# EasyEDA Pro project TDX_Pro_mainboard_1.1.epro

# Board PCB2_2
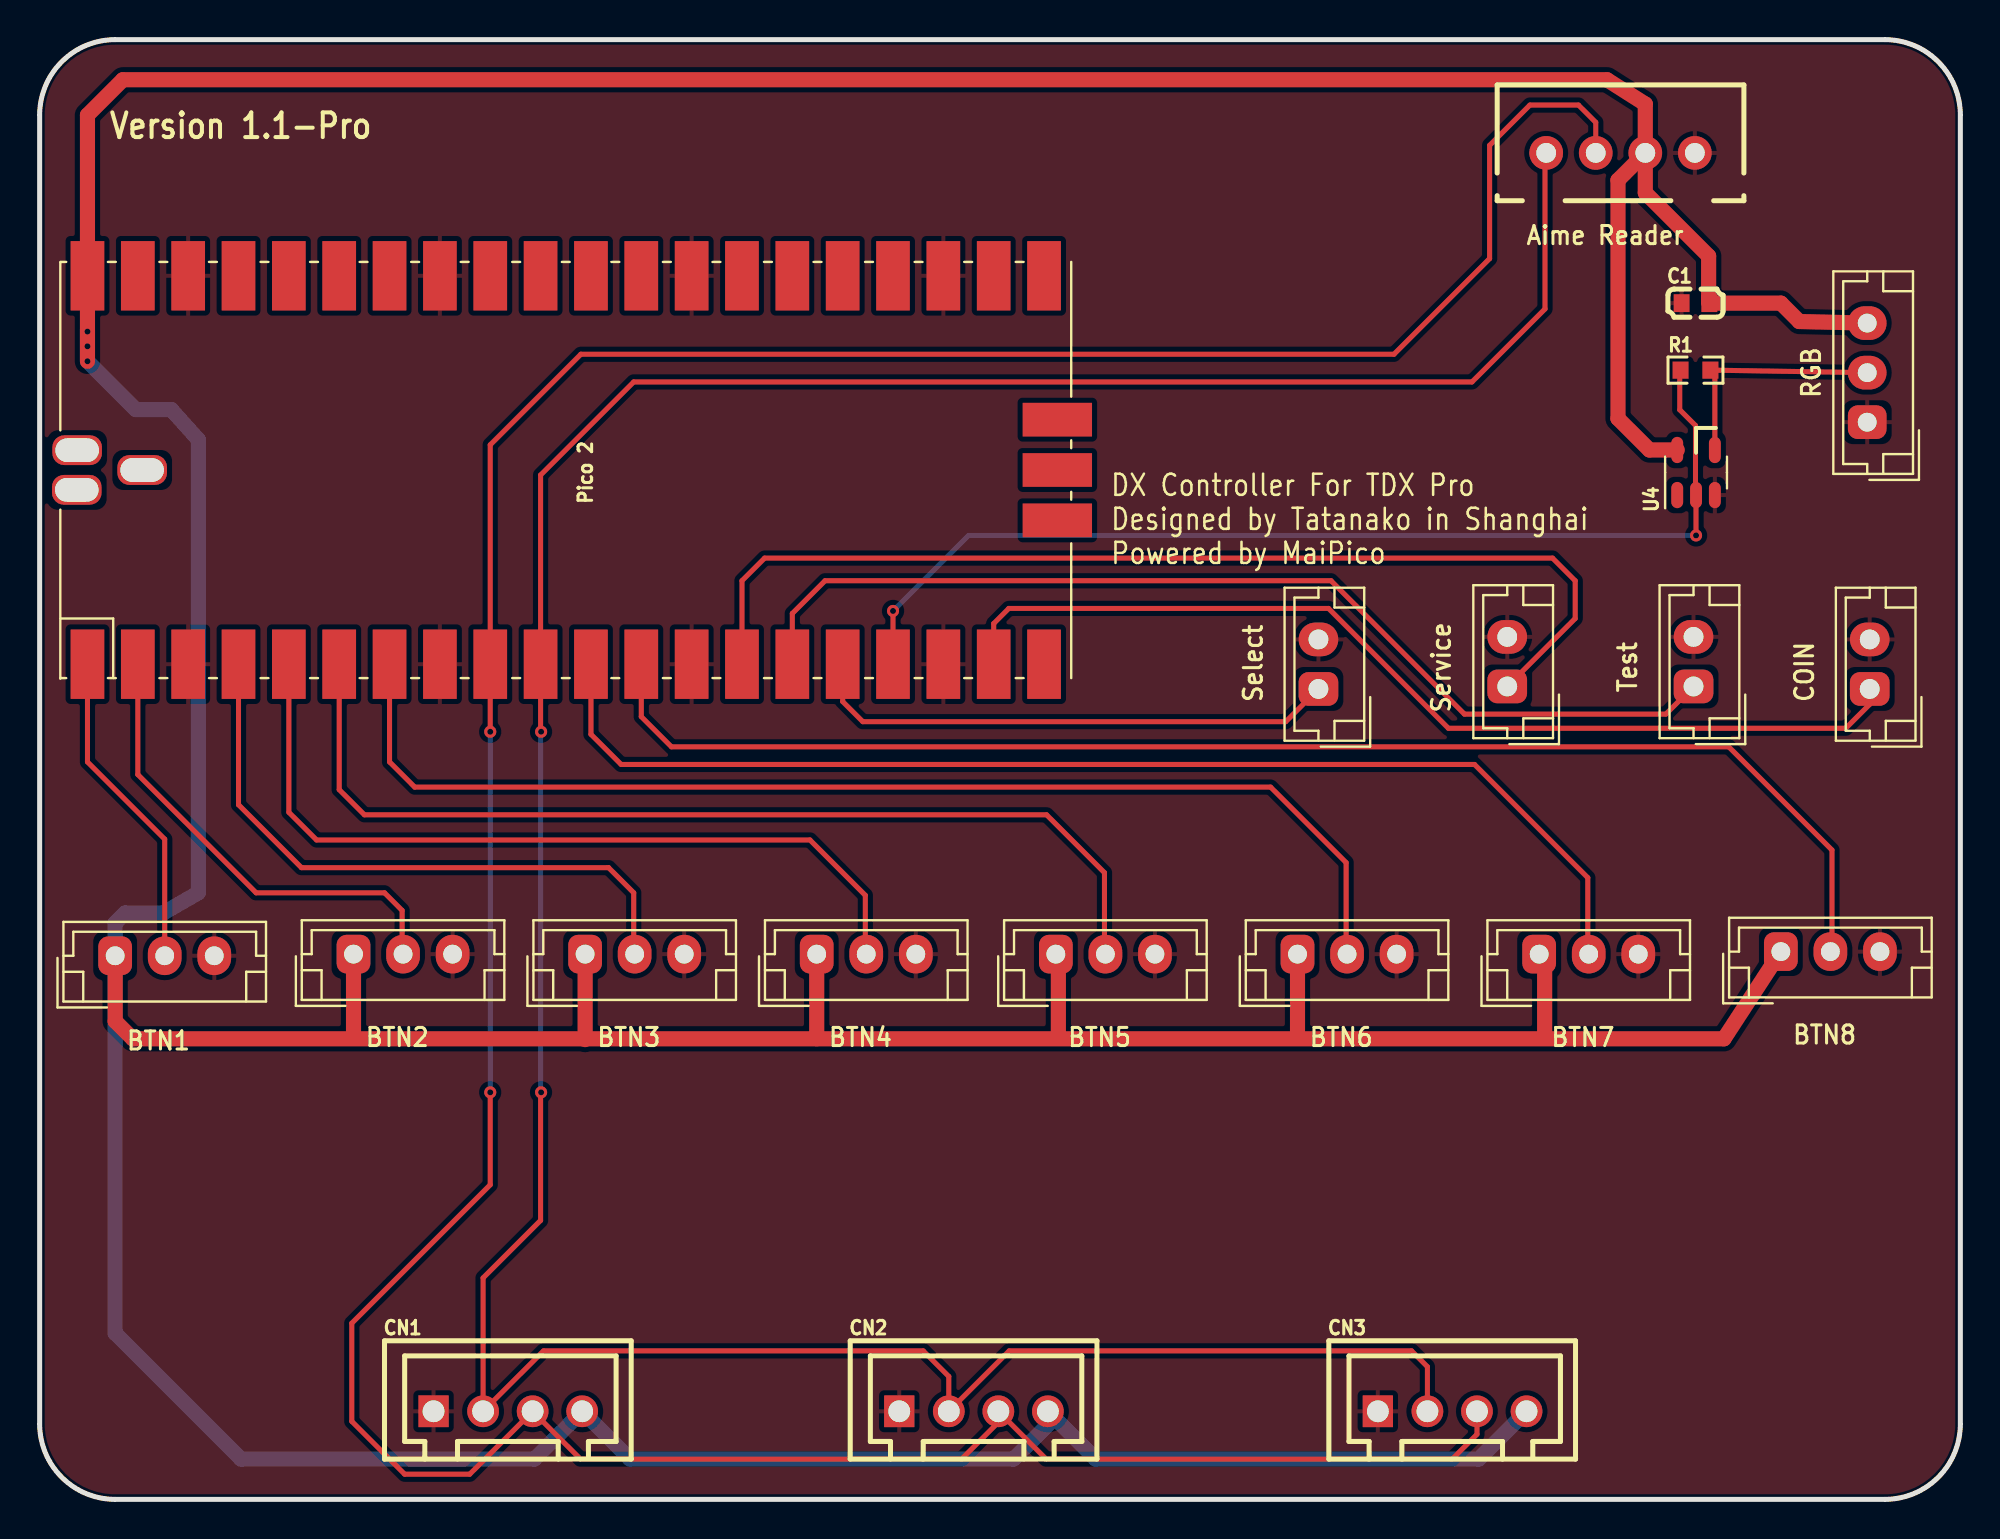
[diagram p0: board, top side]
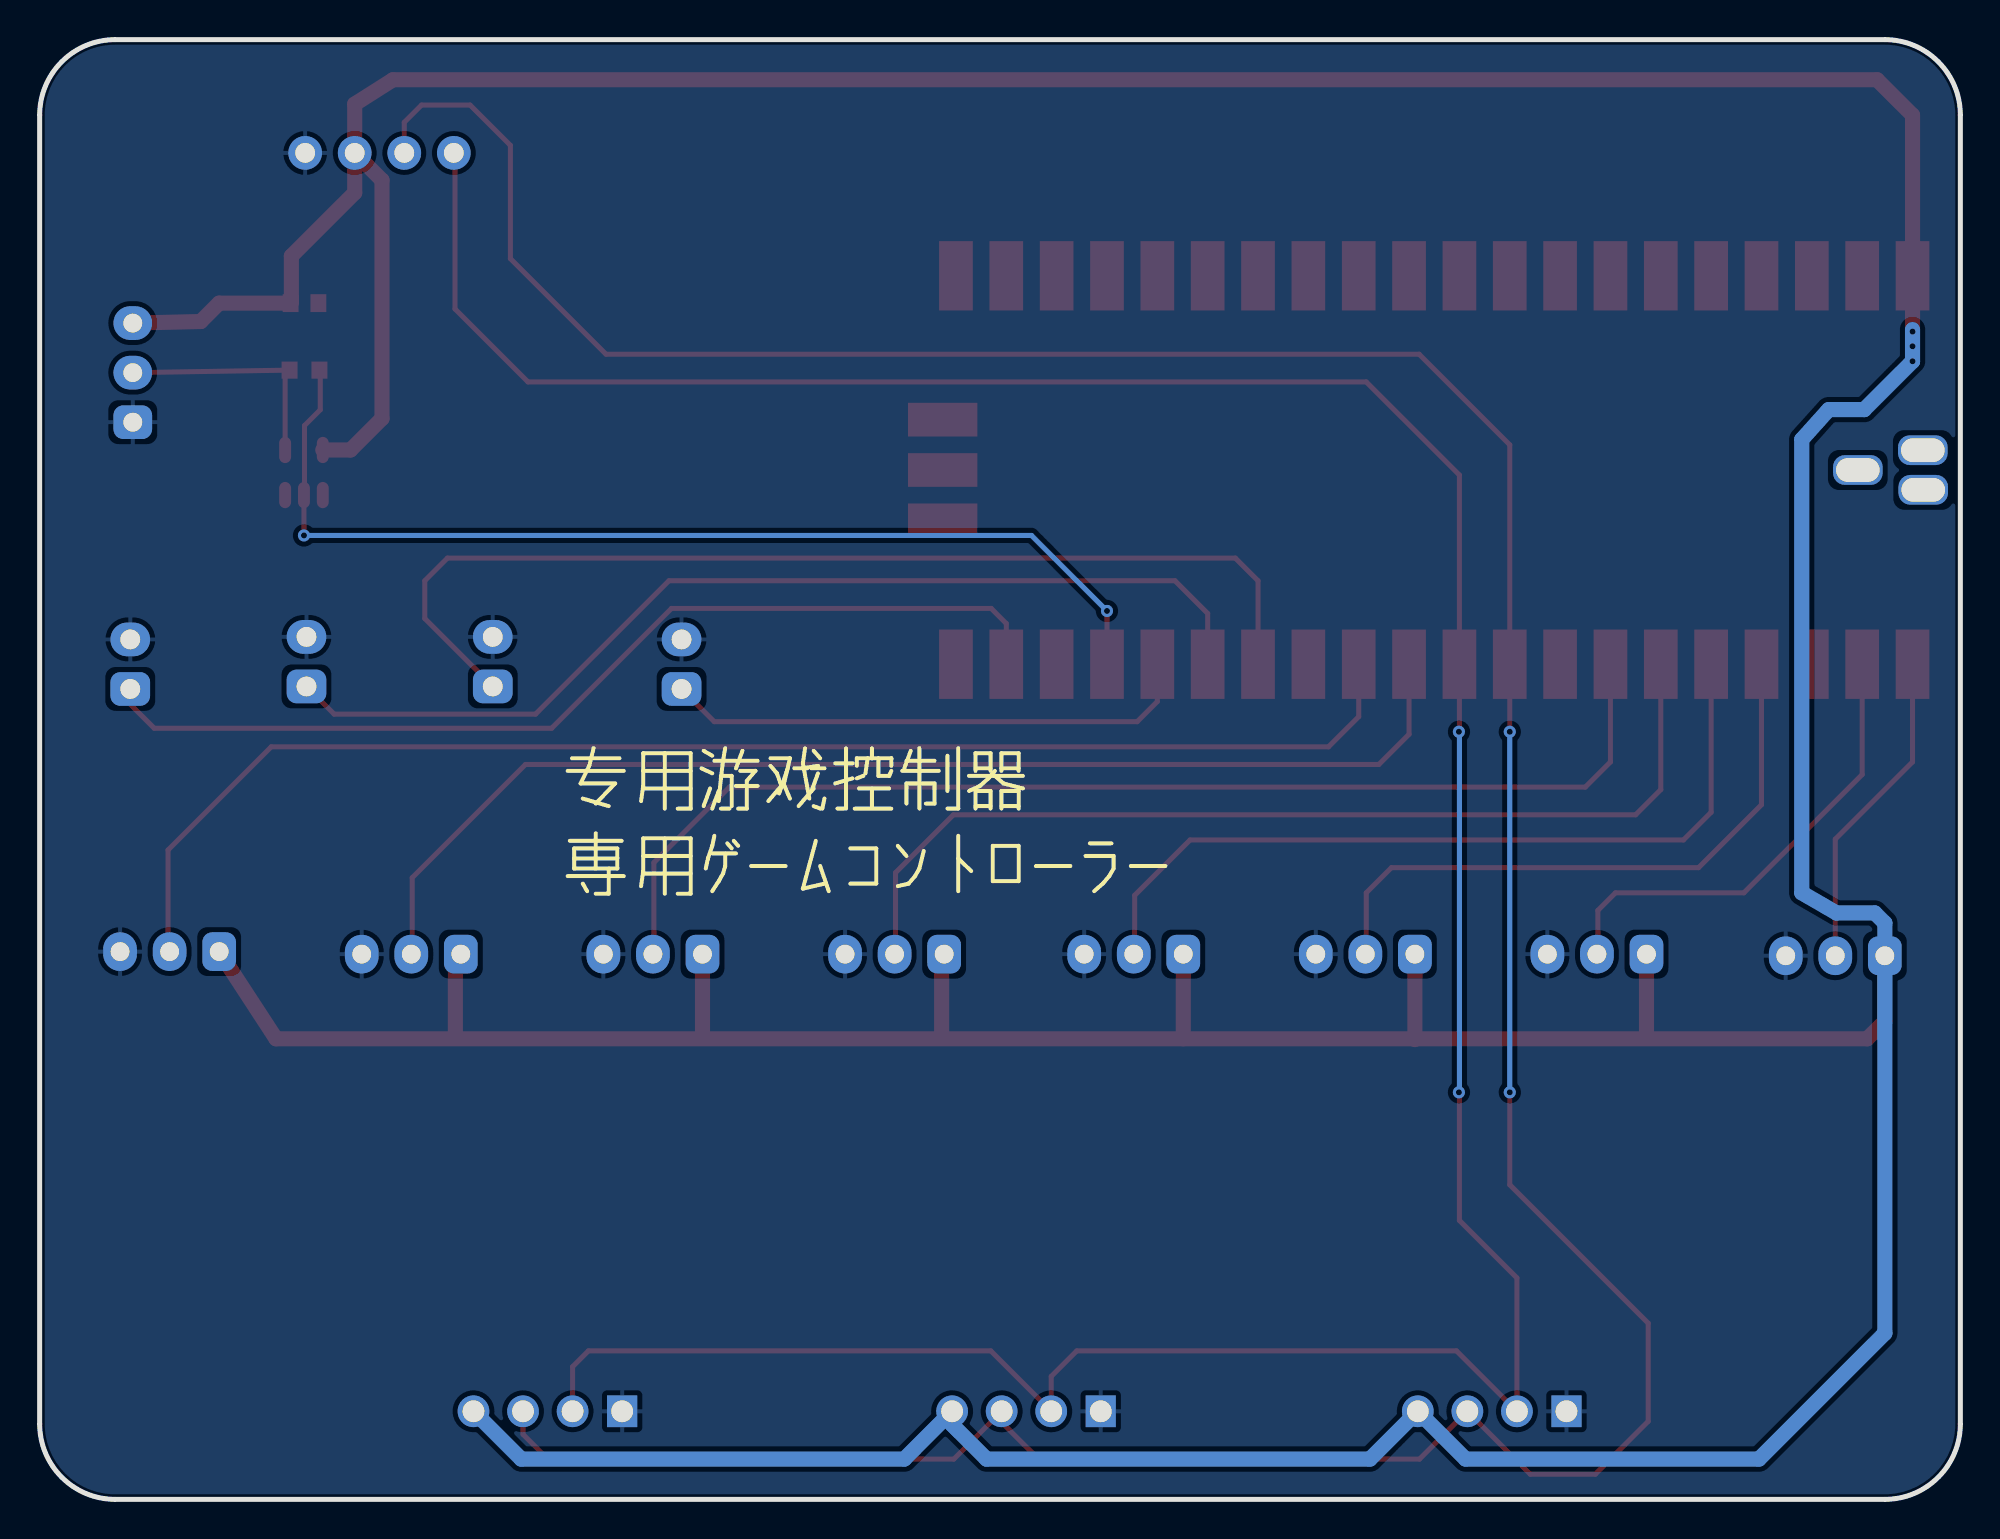
[diagram p1: board, bottom side, seen from below]

Outline 96.9 x 73.66 mm; copper layers: Top Layer, Bottom Layer. Coordinates in mm from the lower left corner of the outline.
Outline path: 0,69.85 0,3.81 arc(1.12,1.12) 3.81,0 93.09,0 arc(95.79,1.12) 96.9,3.81 96.9,69.85 arc(95.79,72.54) 93.09,73.66 3.81,73.66 arc(1.12,72.54) 0,69.85
Stack: Top Layer 0.035mm / Dielectric1 1.51mm FR4 er 4.5 / Bottom Layer 0.035mm

## Design rules (mm)
template: JLCPCB Capability(Two Layers Board)
spacing copperThickness1oz (default): track to track 0.102, other pairs 0.152 to 0.3
spacing copperThickness2oz: track to track 0.203, other pairs 0.152 to 0.3
track width copperThickness1oz (default): min 0.127, default 0.254, max 2.54
track width copperThickness2oz: min 0.203, default 0.254, max 2.54
differential pair differentialPair (default): width min 0.127, default 0.254, max 2.54; gap min 0.152, default 0.152
via viaSize (default): diameter min 0.5, default 0.61, max 10; hole min 0.3, default 0.305, max 6.3

## Placement (name value [footprint] x y rotation side)
Aime Reader  B4B-XH-A(LF)(SN)  [CONN-TH_B4B-XH-A-LF-SN]  79.76 67.94 0 top
BTN1  -  [Connector_JST:JST_EH_B3B-EH-A_1x03_P2.50mm_Vertical]  3.81 27.43 0 top
BTN2  -  [Connector_JST:JST_EH_B3B-EH-A_1x03_P2.50mm_Vertical]  15.84 27.51 0 top
BTN3  -  [Connector_JST:JST_EH_B3B-EH-A_1x03_P2.50mm_Vertical]  27.52 27.51 0 top
BTN4  -  [Connector_JST:JST_EH_B3B-EH-A_1x03_P2.50mm_Vertical]  39.2 27.51 0 top
BTN5  -  [Connector_JST:JST_EH_B3B-EH-A_1x03_P2.50mm_Vertical]  51.27 27.51 0 top
BTN6  -  [Connector_JST:JST_EH_B3B-EH-A_1x03_P2.50mm_Vertical]  63.46 27.51 0 top
BTN7  -  [Connector_JST:JST_EH_B3B-EH-A_1x03_P2.50mm_Vertical]  75.65 27.51 0 top
BTN8  -  [Connector_JST:JST_EH_B3B-EH-A_1x03_P2.50mm_Vertical]  87.84 27.64 0 top
C1  1uF  [C0603]  83.54 60.36 0 top
CN1  ZX-XH2.54-4PZZ  [CONN-TH_4P-P2.50_4PIN]  23.62 4.44 0 top
CN2  ZX-XH2.54-4PZZ  [CONN-TH_4P-P2.50_4PIN]  47.12 4.44 0 top
CN3  ZX-XH2.54-4PZZ  [CONN-TH_4P-P2.50_4PIN]  71.26 4.44 0 top
COIN  -  [Connector_JST:JST_EH_B2B-EH-A_1x02_P2.50mm_Vertical]  92.33 40.89 90 top
Pico 2  -  [mai_io:RPi_Pico_SMD_Pins]  26.54 51.94 90 top
R1  10Ω  [R0603]  83.54 56.98 0 top
RGB  -  [Connector_JST:JST_EH_B3B-EH-A_1x03_P2.50mm_Vertical]  92.2 54.36 90 top
Select  -  [Connector_JST:JST_EH_B2B-EH-A_1x02_P2.50mm_Vertical]  64.52 40.89 90 top
Service  -  [Connector_JST:JST_EH_B2B-EH-A_1x02_P2.50mm_Vertical]  74.04 41.02 90 top
Test  -  [Connector_JST:JST_EH_B2B-EH-A_1x02_P2.50mm_Vertical]  83.44 41.02 90 top
U4  -  [mai_io:SOT-23-5_Jumper]  83.57 51.82 90 top

## Footprints (pads in the part's own frame, mm; a bottom-side part is the same pattern mirrored in y, then rotated)
C0603
  rect 0.8x0.9 smd: 1(-0.7,0) 2(0.7,0)
CONN-TH_4P-P2.50_4PIN
  rect 1.524x1.6 hole 1.1: 1(-3.75,0)
  round 1.6 hole 1.1: 2(-1.25,0) 3(1.25,0) 4(3.75,0)
CONN-TH_B4B-XH-A-LF-SN
  round 1.7 hole 1: 1(3.75,0) 2(1.25,0) 3(-1.25,0) 4(-3.75,0)
Connector_JST:JST_EH_B2B-EH-A_1x02_P2.50mm_Vertical
  rrect 1.7x2 hole 1: 1(0,0)
  oval 1.7x2 hole 1: 2(2.5,0)
Connector_JST:JST_EH_B3B-EH-A_1x03_P2.50mm_Vertical
  rrect 1.7x1.95 hole 0.95: 1(0,0)
  oval 1.7x1.95 hole 0.95: 2(2.5,0) 3(5,0)
mai_io:RPi_Pico_SMD_Pins
  rect 3.5x1.7 smd: 1(-9.8,24.13) 2(-9.8,21.59) 3(-9.8,19.05) 4(-9.8,16.51) 5(-9.8,13.97) 6(-9.8,11.43) 7(-9.8,8.89) 8(-9.8,6.35) 9(-9.8,3.81) 10(-9.8,1.27) 11(-9.8,-1.27) 12(-9.8,-3.81) 13(-9.8,-6.35) 14(-9.8,-8.89) 15(-9.8,-11.43) 16(-9.8,-13.97) 17(-9.8,-16.51) 18(-9.8,-19.05) 19(-9.8,-21.59) 20(-9.8,-24.13) 21(9.8,-24.13) 22(9.8,-21.59) 23(9.8,-19.05) 24(9.8,-16.51) 25(9.8,-13.97) 26(9.8,-11.43) 27(9.8,-8.89) 28(9.8,-6.35) 29(9.8,-3.81) 30(9.8,-1.27) 31(9.8,1.27) 32(9.8,3.81) 33(9.8,6.35) 34(9.8,8.89) 35(9.8,11.43) 36(9.8,13.97) 37(9.8,16.51) 38(9.8,19.05) 39(9.8,21.59) 40(9.8,24.13)
  rect 1.7x3.5 smd: 41(-2.54,-24.8) 42(0,-24.8) 43(2.54,-24.8)
  rrect 1.5x2.5 hole 1.2x2.2: TP1(0,21.37) TP2(1,24.65) TP3(-1,24.67)
mai_io:SOT-23-5_Jumper
  rrect 1.325x0.6 smd: 1(-1.137,0.95) 2(-1.137,0) 3(-1.137,-0.95) 4(1.137,-0.95) 5(1.137,0.95)
R0603
  rect 0.806x0.864 smd: 1(-0.753,0) 2(0.753,0)

## Nets
+3V3: Pico 2.36
+5V: Aime Reader.2 BTN1.1 BTN2.1 BTN3.1 BTN4.1 BTN5.1 BTN6.1 BTN7.1 BTN8.1 C1.2 CN1.4 CN2.4 CN3.4 Pico 2.40 RGB.3 U4.5
GND: Aime Reader.1 BTN1.3 BTN2.3 BTN3.3 BTN4.3 BTN5.3 BTN6.3 BTN7.3 BTN8.3 C1.1 CN1.1 CN2.1 CN3.1 COIN.2 Pico 2.3 Pico 2.8 Pico 2.13 Pico 2.18 Pico 2.23 Pico 2.28 Pico 2.33 Pico 2.38 RGB.1 Select.2 Service.2 Test.2 U4.3
BTN1_S: BTN1.2 Pico 2.1
BTN2_S: BTN2.2 Pico 2.2
BTN3_S: BTN3.2 Pico 2.4
BTN4_S: BTN4.2 Pico 2.5
BTN5_S: BTN5.2 Pico 2.6
BTN6_S: BTN6.2 Pico 2.7
BTN7_S: BTN7.2 Pico 2.11
BTN8_S: BTN8.2 Pico 2.12
K_COIN_S: COIN.1 Pico 2.19
K_SELECT_S: Pico 2.16 Select.1
K_SERVICE_S: Pico 2.15 Test.1
K_TEST_S: Pico 2.14 Service.1
RGB_S: R1.2 RGB.2 U4.4
RGB_S_A: Pico 2.17 R1.1 U4.2
SCL: Aime Reader.4 CN1.2 CN2.2 CN3.2 Pico 2.10
SDA: Aime Reader.3 CN1.3 CN2.3 CN3.3 Pico 2.9

Pads without a net: Pico 2 20 21 22 24 25 26 27 29 30 31 32 34 35 37 39 41 42 43 TP1 TP2 TP3; U4 1

## Via types
v1: diameter 0.61, hole 0.305, Top Layer to Bottom Layer, 9 vias

## Routing (per net, layer and track width the routed paths; a pad name or vN(x,y) marks a point on that pad's centre or on a via; arc(x,y) is an arc through that point)
+5V: length 380.2
  Top Layer w0.762: 2.41,62.89 2.41,69.85 4.2,71.64 79.08,71.64 81.01,70.41 Aime Reader.2 ; Pico 2.40 v1(2.41,57.43) ; BTN1.1 3.81,24.13 4.7,23.24 84.97,23.24 BTN8.1 ; BTN2.1 15.84,23.3 ; BTN3.1 27.52,23.2 ; BTN4.1 39.2,23.24 ; 51.4,27.51 51.4,23.26 ; 63.46,27.64 63.46,23.33 ; 75.8,27.39 75.93,27.39 75.93,23.42 ; Aime Reader.2 79.63,66.57 79.63,54.54 81.22,52.95 U4.5 ; Aime Reader.2 81.01,65.93 84.2,62.74 84.2,60.4 C1.2 87.85,60.36 88.77,59.44 RGB.3
  Bottom Layer w0.762: 2.41,59.03 v1(2.41,57.43) 4.85,54.99 6.64,54.99 8,53.48 8,30.61 6.25,29.59 4.32,29.59 3.81,29.08 BTN1.1 3.81,8.38 10.16,2.03 24.96,2.03 CN1.4 29.79,2.03 49.13,2.03 50.87,3.77 CN2.4 53.28,2.03 72.6,2.03 CN3.4
  vias: v1(2.41,58.93) v1(2.41,58.18)
RGB_S_A: length 53.5
  Top Layer w0.254: v1(43.05,44.83) Pico 2.17 ; 82.74,56.98 82.74,54.98 83.54,54.19 83.54,50.71 U4.2 v1(83.57,48.64)
  Bottom Layer w0.254: v1(43.05,44.83) 46.86,48.64 v1(83.57,48.64)
SCL: length 165.6
  Top Layer w0.254: v1(25.3,38.73) 25.27,38.76 Pico 2.10 25.27,51.69 29.97,56.39 72.26,56.39 75.95,60.07 75.95,67.89 Aime Reader.4 ; 25.27,20.51 25.27,14.08 22.37,11.18 CN1.2 25.42,7.49 44.58,7.49 45.87,6.2 CN2.2 48.92,7.49 69.22,7.49 70.01,6.69 CN3.2
  Bottom Layer w0.254: 25.27,38.76 25.27,20.57 v1(25.3,20.54)
SDA: length 184.5
  Top Layer w0.254: v1(22.73,38.73) Pico 2.9 22.73,53.21 27.31,57.79 68.33,57.79 73.15,62.61 73.15,68.33 75.18,70.36 77.63,70.36 78.51,69.49 Aime Reader.3 ; v1(22.73,20.54) 22.73,15.88 15.75,8.89 15.75,3.94 18.42,1.27 21.7,1.27 CN1.3 27.29,2.03 46.51,2.03 48.37,3.89 CN2.3 50.78,2.03 71.26,2.03 72.51,3.28 CN3.3
  Bottom Layer w0.254: v1(22.73,38.73) v1(22.73,20.54)
BTN1_S: length 16.8
  Top Layer w0.254: 2.41,42.65 2.41,37.21 6.31,33.31 BTN1.2
BTN2_S: length 24
  Top Layer w0.254: Pico 2.2 4.95,36.58 10.92,30.61 17.4,30.61 18.29,29.72 18.29,27.56 BTN2.2
BTN3_S: length 32
  Top Layer w0.254: Pico 2.4 10.03,35.05 13.21,31.88 28.7,31.88 29.97,30.61 29.97,27.56 BTN3.2
BTN4_S: length 41.3
  Top Layer w0.254: Pico 2.5 12.57,34.67 13.97,33.27 38.86,33.27 41.66,30.48 41.66,27.56 BTN4.2
BTN5_S: length 50.8
  Top Layer w0.254: Pico 2.6 15.11,35.81 16.38,34.54 50.8,34.54 53.72,31.62 53.72,27.56 BTN5.2
BTN6_S: length 59.9
  Top Layer w0.254: Pico 2.7 17.65,37.21 18.92,35.94 62.1,35.94 65.91,32.13 65.91,27.56 BTN6.2
BTN7_S: length 60.7
  Top Layer w0.254: Pico 2.11 27.81,38.61 29.34,37.08 72.39,37.08 78.11,31.37 78.11,27.56 BTN7.2
BTN8_S: length 70.7
  Top Layer w0.254: Pico 2.12 30.35,39.5 31.88,37.97 85.22,37.97 90.42,32.77 90.42,27.72 BTN8.2
K_COIN_S: length 50.3
  Top Layer w0.254: Pico 2.19 48.13,44.2 48.9,44.96 65.02,44.96 71.07,38.91 91.12,38.91 92.33,40.12 COIN.1
K_SELECT_S: length 27
  Top Layer w0.254: Pico 2.16 40.51,40.26 41.53,39.24 62.87,39.24 Select.1
K_SERVICE_S: length 52.1
  Top Layer w0.254: Pico 2.15 37.97,44.7 39.62,46.36 65.15,46.36 71.88,39.62 82.04,39.62 Test.1
K_TEST_S: length 54
  Top Layer w0.254: Pico 2.14 35.43,46.36 36.58,47.5 76.33,47.5 77.47,46.36 77.47,44.45 Service.1
RGB_S: length 12
  Top Layer w0.254: RGB.2 R1.2 84.52,56.76 U4.4

## Copper pours and planes (outline as drawn; the poured copper is in the pictures)
GND on Top Layer: -1.78,75.56 98.68,75.56 98.68,-1.4 -1.78,-1.4
GND on Bottom Layer: -3.94,76.83 100.2,76.83 100.2,-2.67 -3.94,-2.67

## Text on the board
Bottom Silkscreen Layer: 专用游戏控制器 / 専用ゲームコントローラー
Top Silkscreen Layer: DX Controller For TDX Pro / Designed by Tatanako in Shanghai / Powered by MaiPico | Version 1.1-Pro
